# EasyEDA Pro project USB Hub Switch.eprj, schematic Smart Switch Variant

## Sheets
1 Upstream Ports: Board Name: Smart Switch Variant; Create Date: 2026-01-22; Page Name: Upstream Ports; Project Name: USB Hub Switch; Schematic Name: Smart Switch Variant; Update Date: 2026-01-29
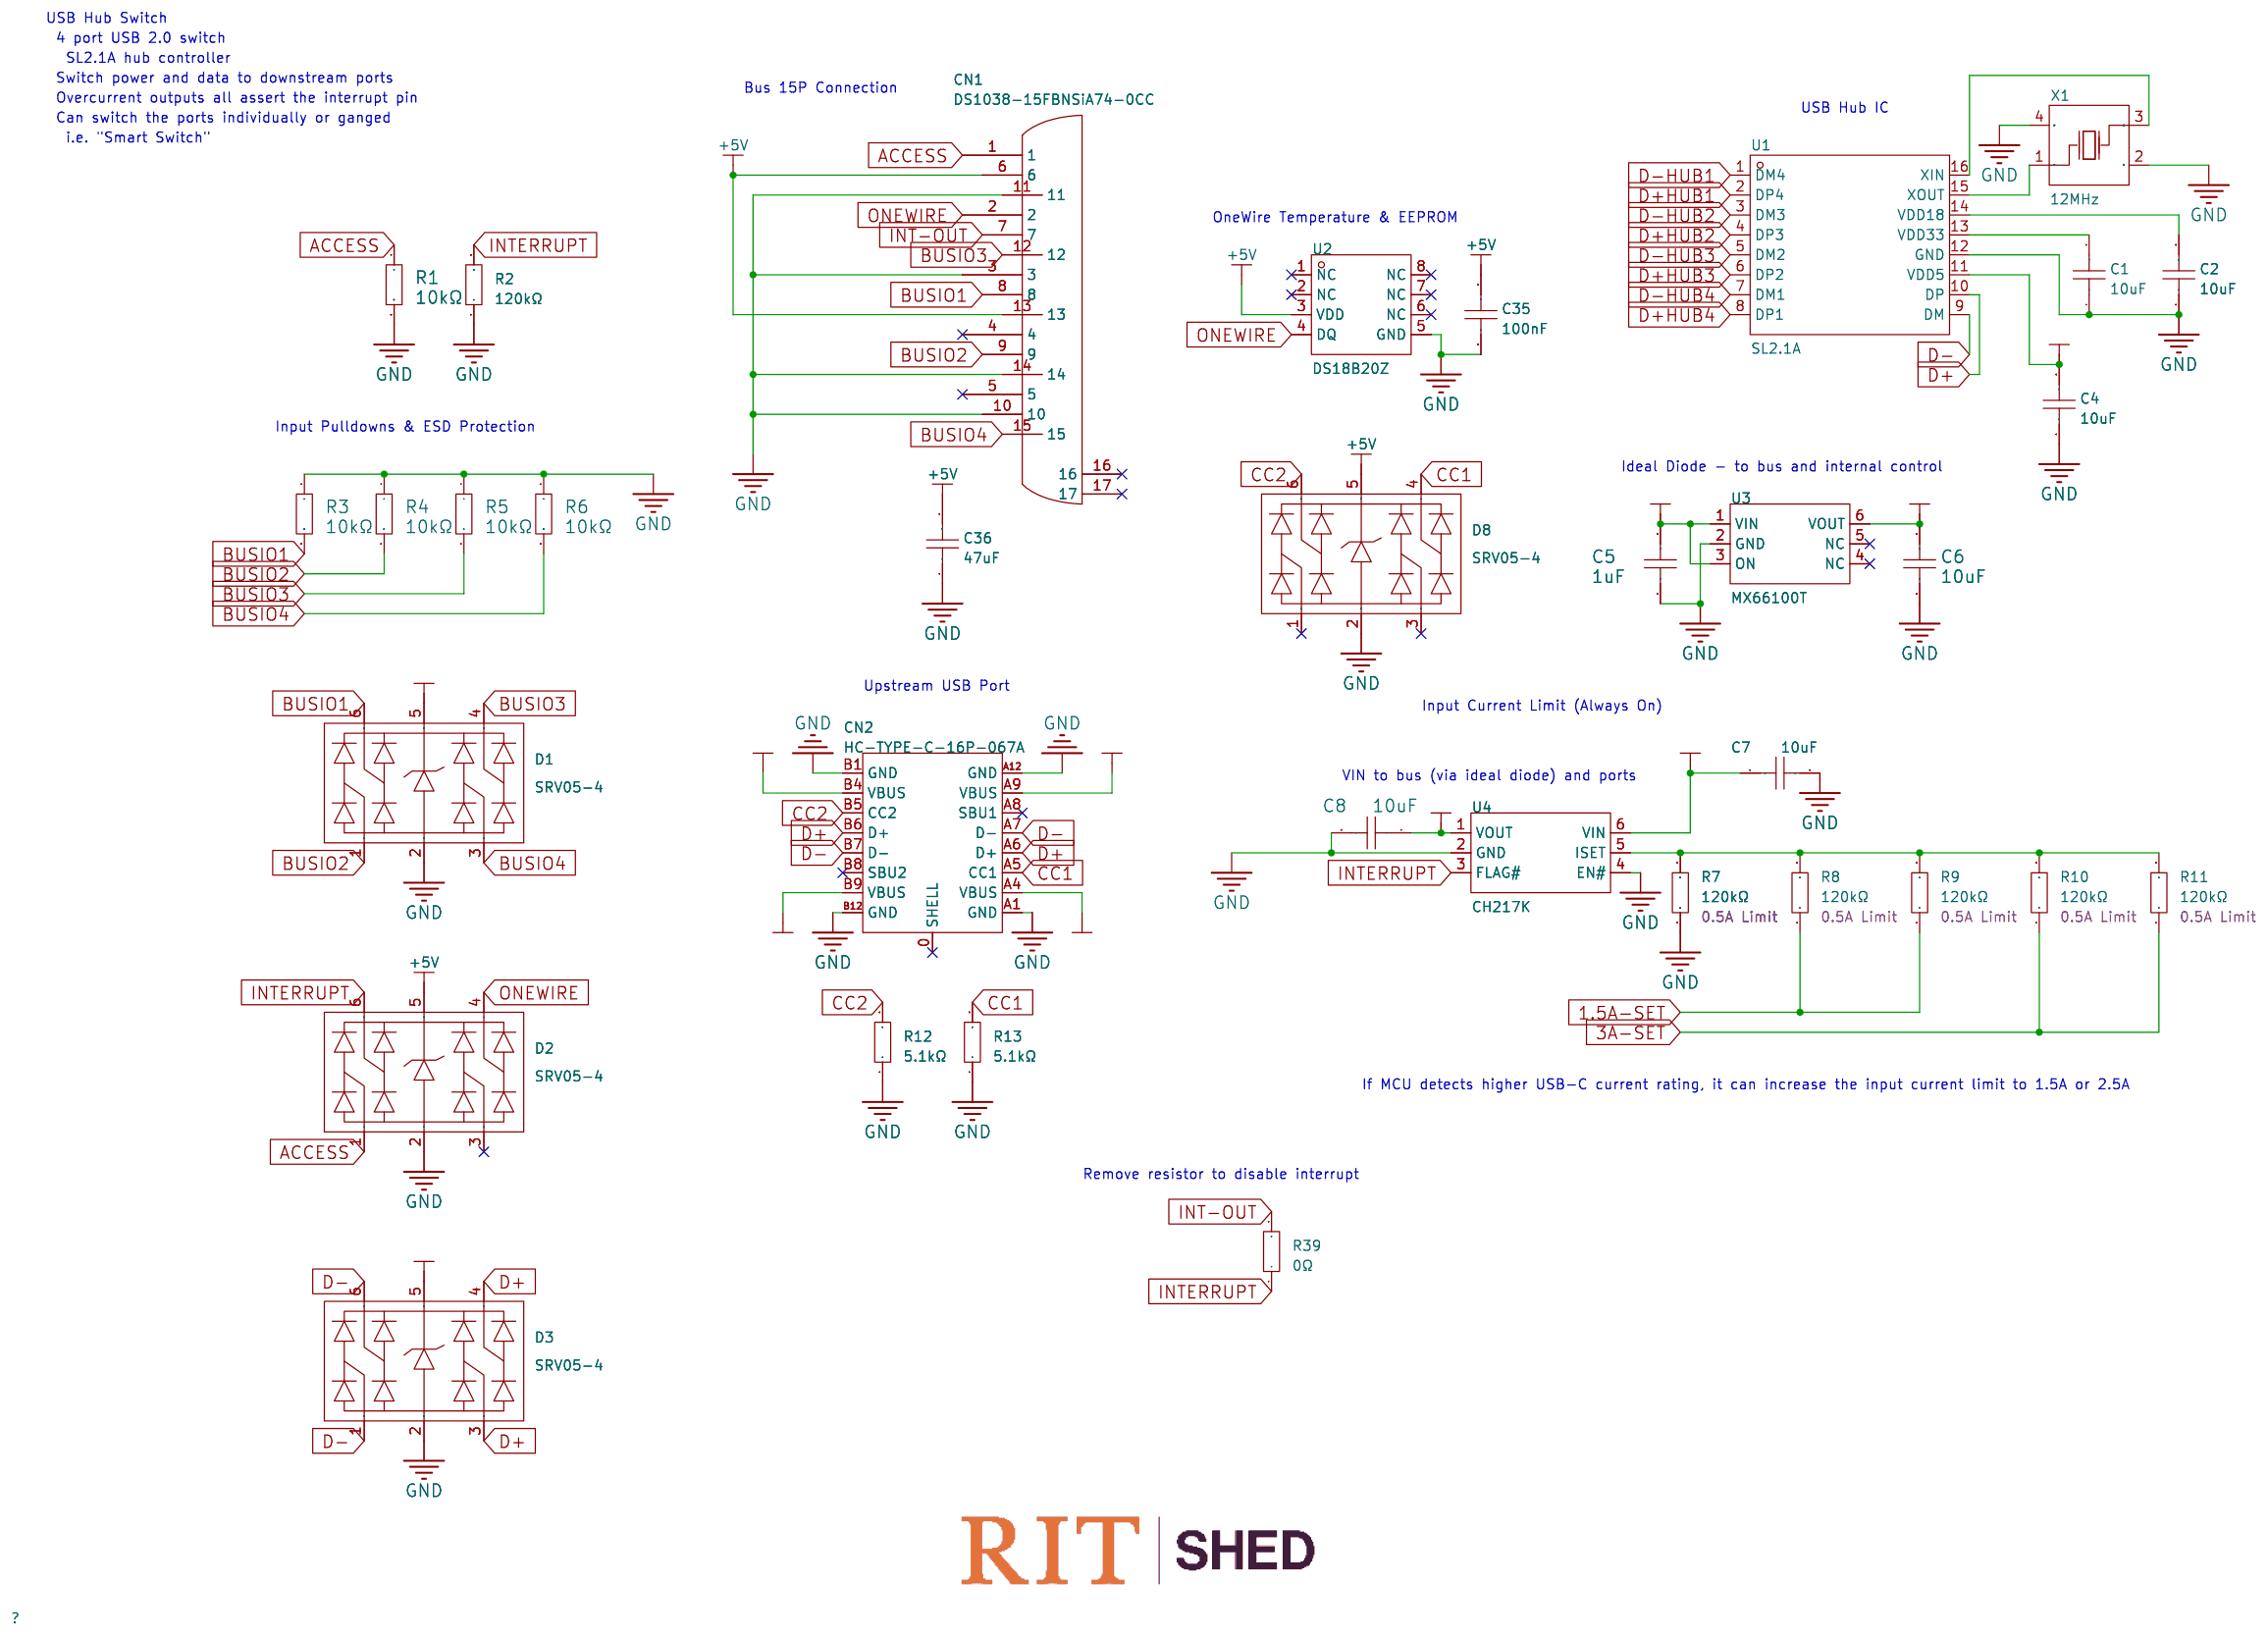
[diagram p0: Upstream Ports]
2 Downstream Ports: Page Name: Downstream Ports; Update Date: 2026-01-27
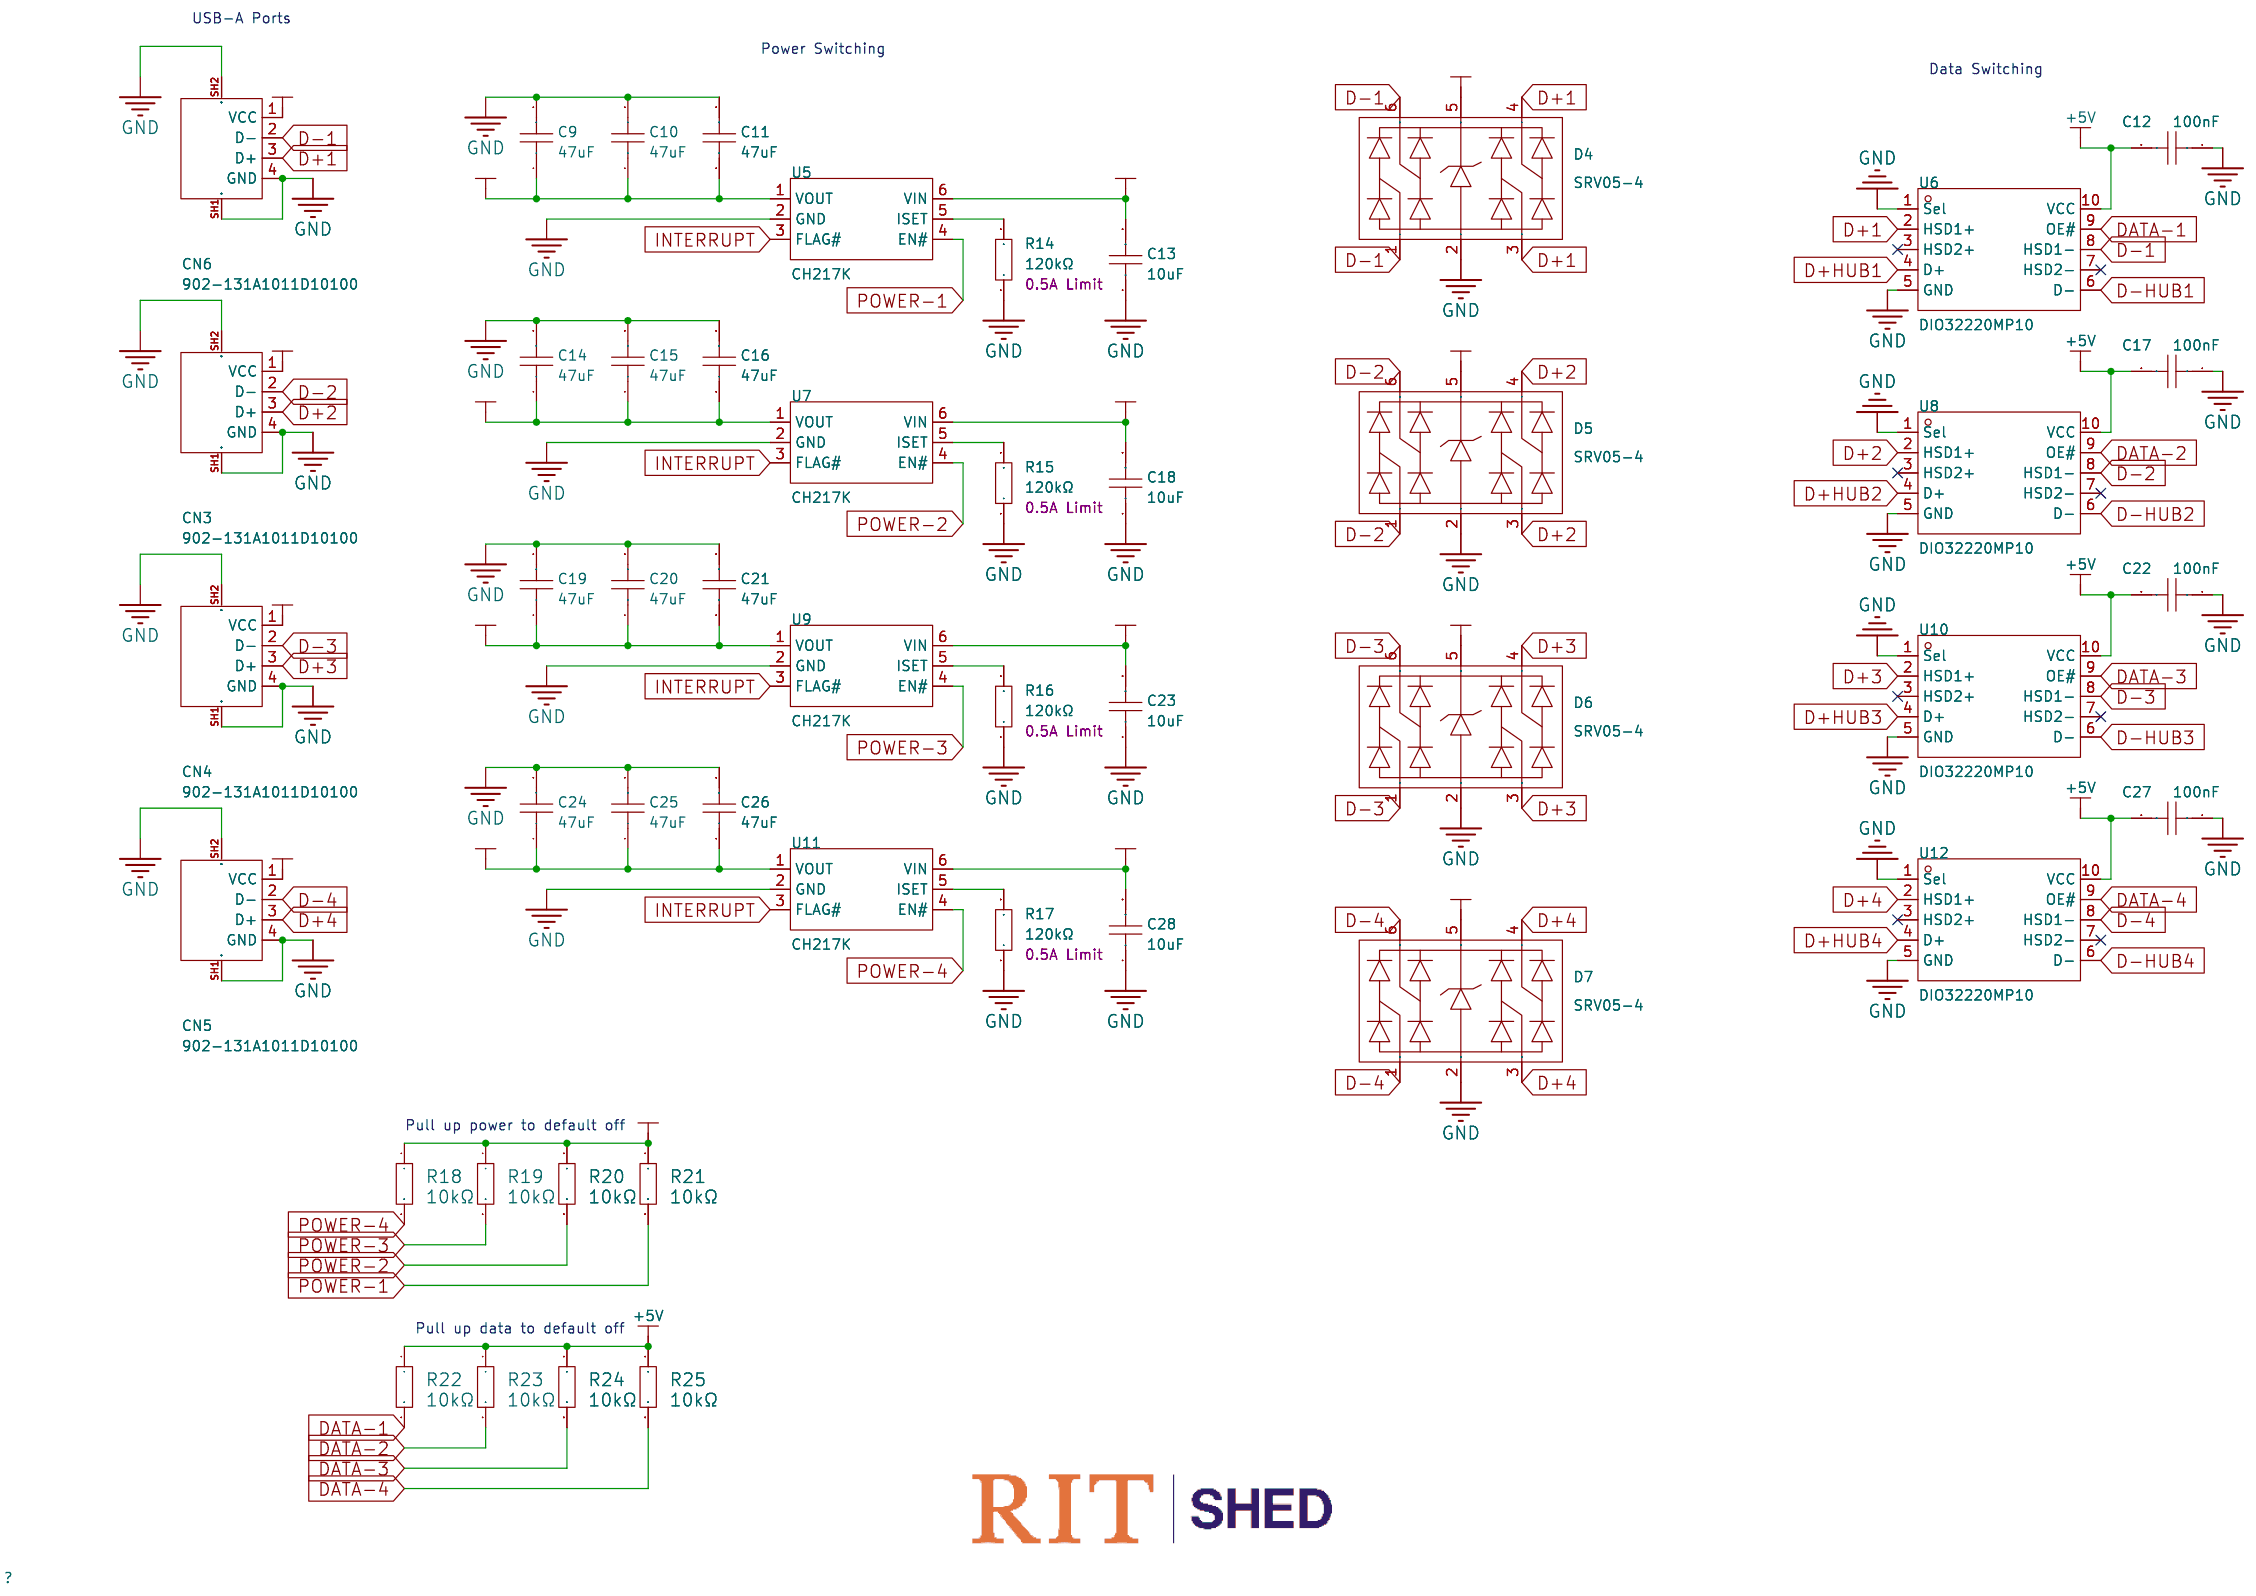
[diagram p1: Downstream Ports]
3 Microcontroller: Page Name: Microcontroller; Update Date: 2026-01-27
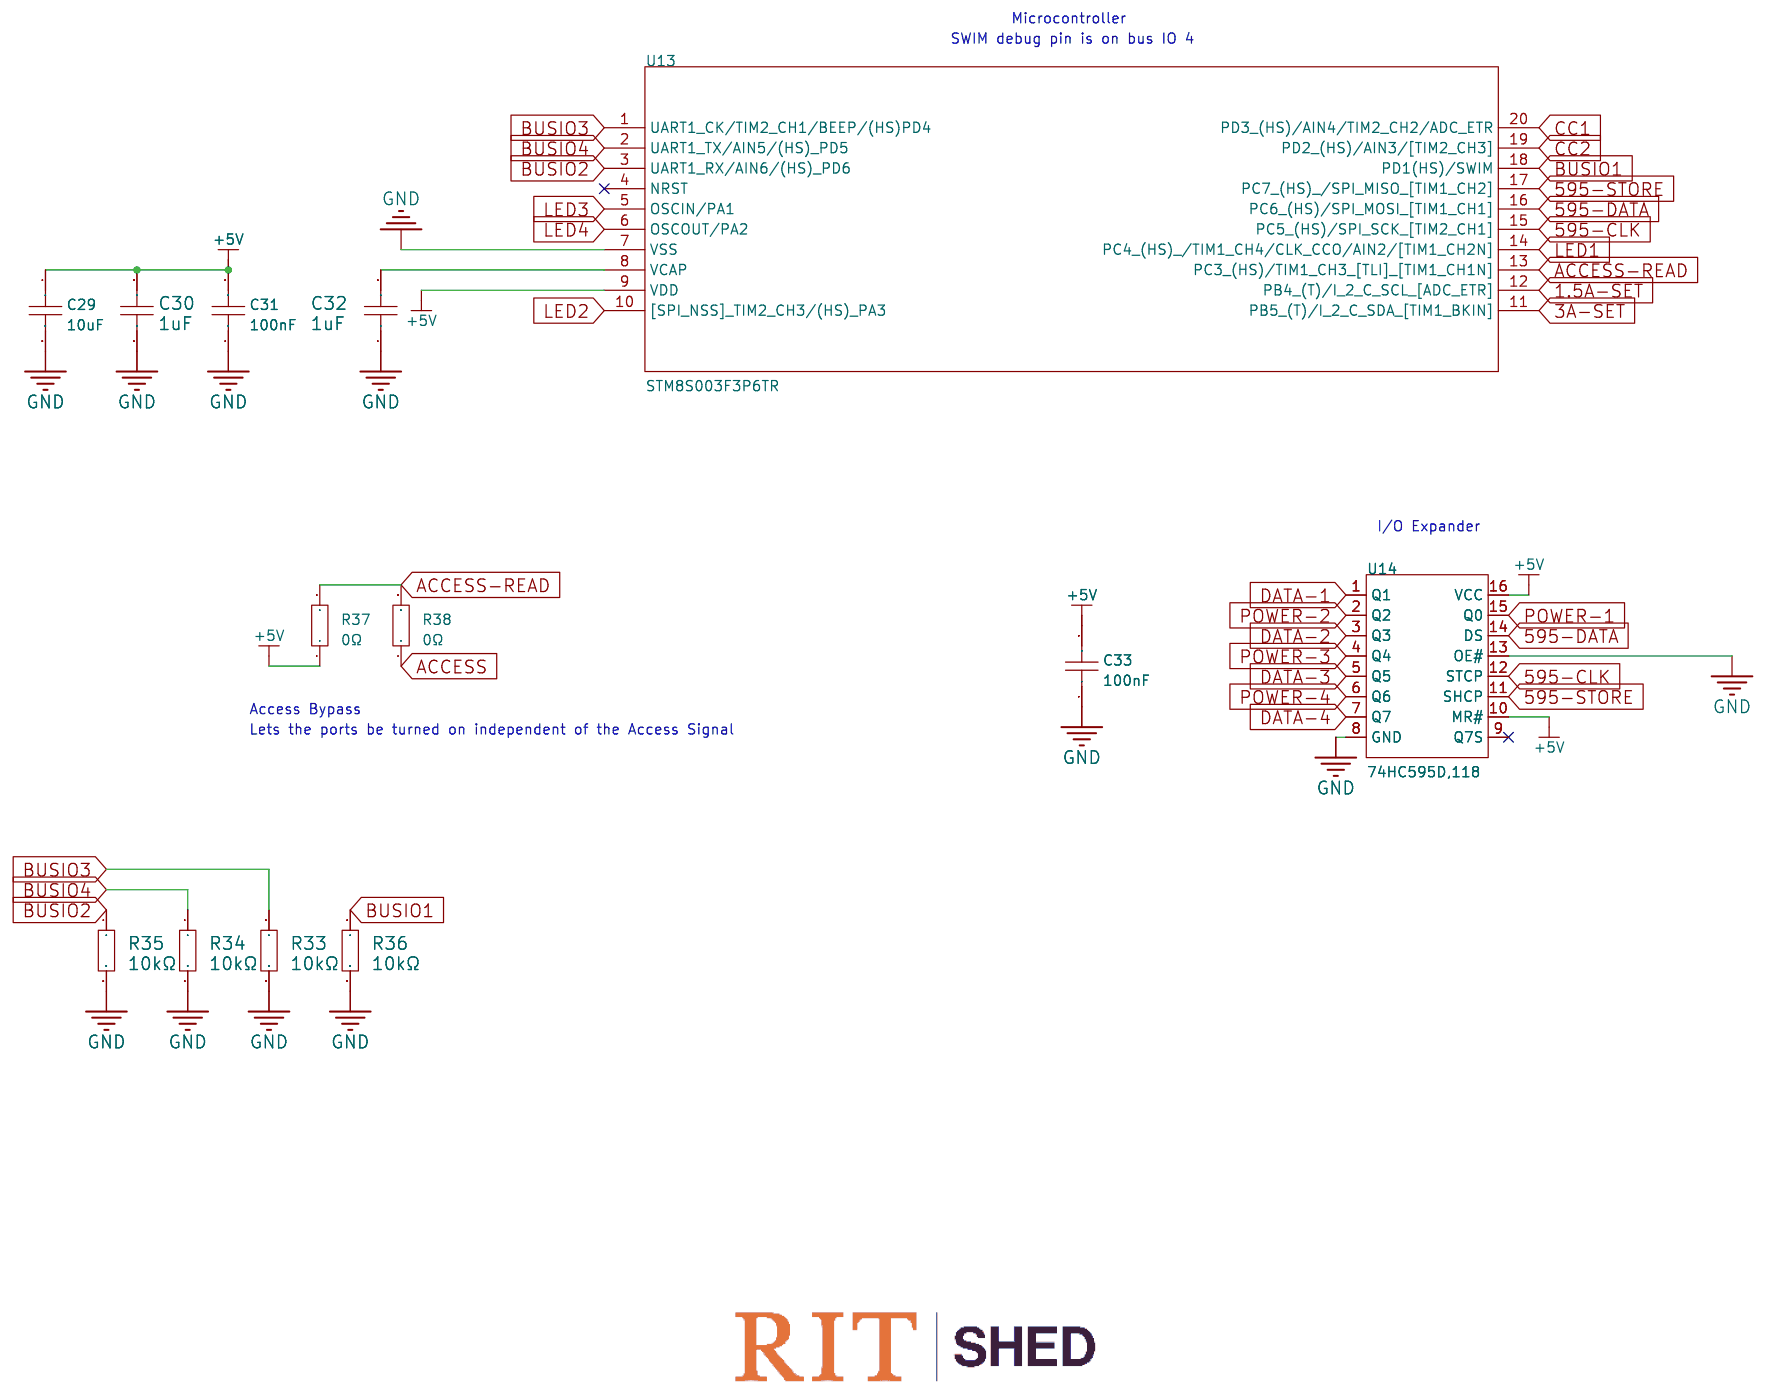
[diagram p2: Microcontroller]
4 Status LEDs: Create Date: 2026-01-23; Page Name: Status LEDs; Update Date: 2026-01-27
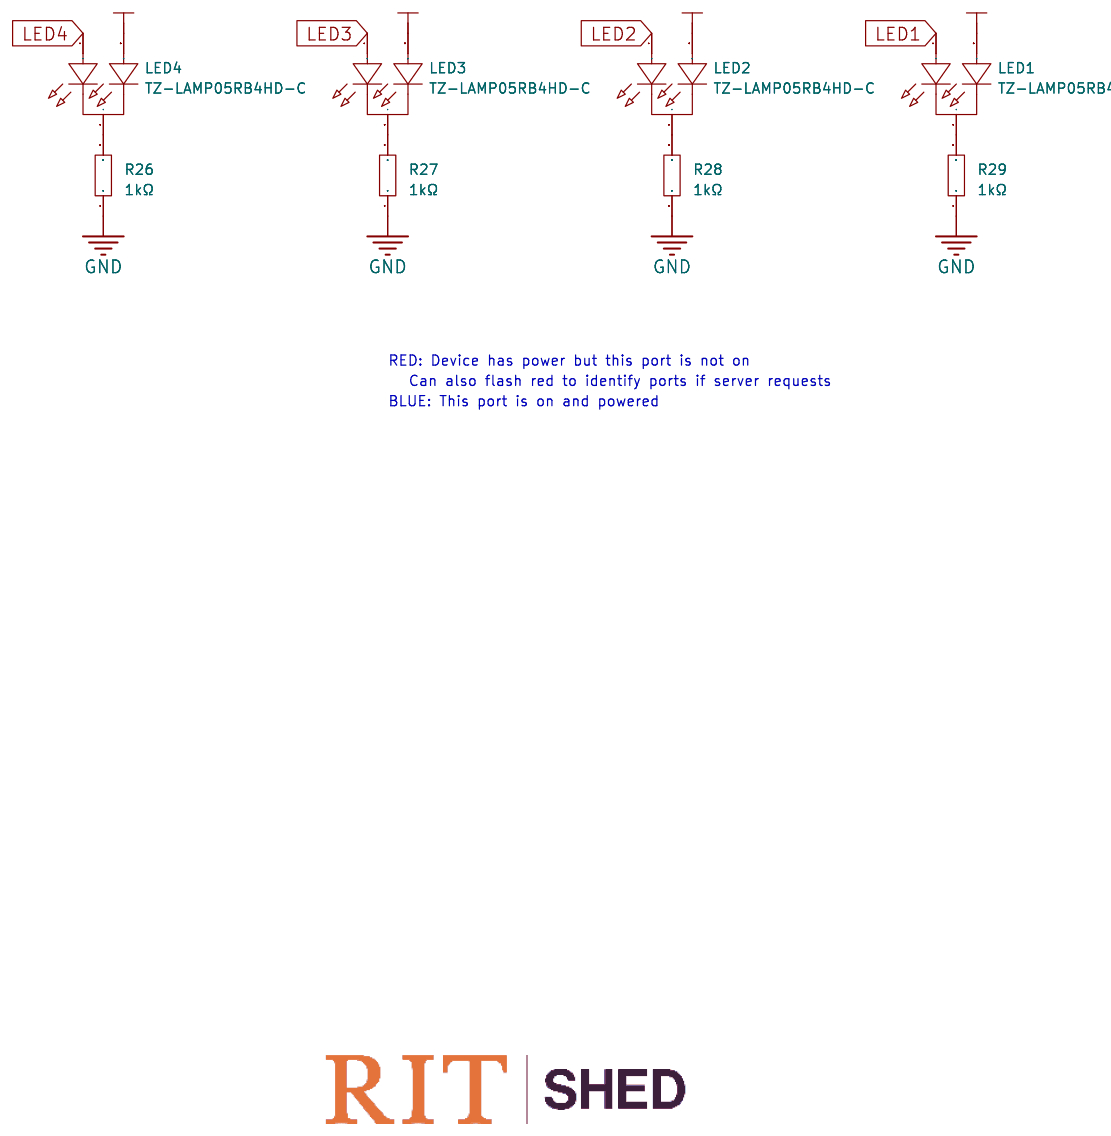
[diagram p3: Status LEDs]

## Parts
sheet Downstream Ports
C9  47uF  [C1206]
C10  47uF  [C1206]
C11  47uF  [C1206]
C12  100nF  [C0603]
C13  10uF  [C0603]
C14  47uF  [C1206]
C15  47uF  [C1206]
C16  47uF  [C1206]
C17  100nF  [C0603]
C18  10uF  [C0603]
C19  47uF  [C1206]
C20  47uF  [C1206]
C21  47uF  [C1206]
C22  100nF  [C0603]
C23  10uF  [C0603]
C24  47uF  [C1206]
C25  47uF  [C1206]
C26  47uF  [C1206]
C27  100nF  [C0603]
C28  10uF  [C0603]
CN3  902-131A1011D10100  [USB-A-TH__USB-AF-90]
CN4  902-131A1011D10100  [USB-A-TH__USB-AF-90]
CN5  902-131A1011D10100  [USB-A-TH__USB-AF-90]
CN6  902-131A1011D10100  [USB-A-TH__USB-AF-90]
D4  SRV05-4  [SOT-23-6_L2.9-W1.6-P0.95-LS2.8-BL]
D5  SRV05-4  [SOT-23-6_L2.9-W1.6-P0.95-LS2.8-BL]
D6  SRV05-4  [SOT-23-6_L2.9-W1.6-P0.95-LS2.8-BL]
D7  SRV05-4  [SOT-23-6_L2.9-W1.6-P0.95-LS2.8-BL]
R14  120kΩ  [R0603]
R15  120kΩ  [R0603]
R16  120kΩ  [R0603]
R17  120kΩ  [R0603]
R18  10kΩ  [R0603]
R19  10kΩ  [R0603]
R20  10kΩ  [R0603]
R21  10kΩ  [R0603]
R22  10kΩ  [R0603]
R23  10kΩ  [R0603]
R24  10kΩ  [R0603]
R25  10kΩ  [R0603]
U5  CH217K  [SOT-23-6_L2.9-W1.6-P0.95-LS2.8-BL]
U6  DIO32220MP10  [MSOP-10_L3.0-W3.0-P0.50-LS5.0-BL]
U7  CH217K  [SOT-23-6_L2.9-W1.6-P0.95-LS2.8-BL]
U8  DIO32220MP10  [MSOP-10_L3.0-W3.0-P0.50-LS5.0-BL]
U9  CH217K  [SOT-23-6_L2.9-W1.6-P0.95-LS2.8-BL]
U10  DIO32220MP10  [MSOP-10_L3.0-W3.0-P0.50-LS5.0-BL]
U11  CH217K  [SOT-23-6_L2.9-W1.6-P0.95-LS2.8-BL]
U12  DIO32220MP10  [MSOP-10_L3.0-W3.0-P0.50-LS5.0-BL]
sheet Microcontroller
C29  10uF  [C0603]
C30  1uF  [C0603]
C31  100nF  [C0603]
C32  1uF  [C0603]
C33  100nF  [C0603]
R33  10kΩ  [R0603]
R34  10kΩ  [R0603]
R35  10kΩ  [R0603]
R36  10kΩ  [R0603]
R37  0Ω  [R0805]
R38  0Ω  [R0805]
U13  STM8S003F3P6TR  [TSSOP-20_L6.5-W4.4-P0.65-LS6.4-BL]
U14  74HC595D,118  [SOIC-16_L9.9-W3.9-P1.27-LS6.0-BL]
sheet Status LEDs
LED1  TZ-LAMP05RB4HD-C  [LED-TH_3P-BD5.8-P2.54-R-BI]
LED2  TZ-LAMP05RB4HD-C  [LED-TH_3P-BD5.8-P2.54-R-BI]
LED3  TZ-LAMP05RB4HD-C  [LED-TH_3P-BD5.8-P2.54-R-BI]
LED4  TZ-LAMP05RB4HD-C  [LED-TH_3P-BD5.8-P2.54-R-BI]
R26  1kΩ  [R0805]
R27  1kΩ  [R0805]
R28  1kΩ  [R0805]
R29  1kΩ  [R0805]
sheet Upstream Ports
C1  10uF  [C0603]
C2  10uF  [C0603]
C4  10uF  [C0603]
C5  1uF  [C0603]
C6  10uF  [C0603]
C7  10uF  [C0603]
C8  10uF  [C0603]
C35  100nF  [C0603]
C36  47uF  [C1206]
CN1  DS1038-15FBNSiA74-0CC  [DSUB-TH_DS1038-15FBNSIA74-0CC]
CN2  HC-TYPE-C-16P-067A  [USB-SMD_HC-TYPE-C-16P-FLS7.2-5A-11]
D1  SRV05-4  [SOT-23-6_L2.9-W1.6-P0.95-LS2.8-BL]
D2  SRV05-4  [SOT-23-6_L2.9-W1.6-P0.95-LS2.8-BL]
D3  SRV05-4  [SOT-23-6_L2.9-W1.6-P0.95-LS2.8-BL]
D8  SRV05-4  [SOT-23-6_L2.9-W1.6-P0.95-LS2.8-BL]
R1  10kΩ  [R0603]
R2  120kΩ  [R0603]
R3  10kΩ  [R0603]
R4  10kΩ  [R0603]
R5  10kΩ  [R0603]
R6  10kΩ  [R0603]
R7  120kΩ  [R0603]
R8  120kΩ  [R0603]
R9  120kΩ  [R0603]
R10  120kΩ  [R0603]
R11  120kΩ  [R0603]
R12  5.1kΩ  [R0603]
R13  5.1kΩ  [R0603]
R39  0Ω  [R0805]
U1  SL2.1A  [SOP-16_L10.0-W3.9-P1.27-LS6.0-BL]
U2  DS18B20Z  [SOP-8_L4.9-W3.9-P1.27-LS6.0-BL]
U3  MX66100T  [SOT-23-6_L2.9-W1.6-P0.95-LS2.9-BL]
U4  CH217K  [SOT-23-6_L2.9-W1.6-P0.95-LS2.8-BL]
X1  12MHz  [OSC-SMD_4P-L3.2-W2.5-BL]

## Library data of the parts
C9-C11 C14-C16 C19-C21 C24-C26 C36 = CL31A476MPHNNNE: LCSC Part Name: 47uF ±20% 10V; Supplier Part: C96123; Manufacturer: SAMSUNG(三星); Supplier Footprint: 1206; Datasheet: https://item.szlcsc.com/datasheet/CL31A476MPHNNNE/97327.html; Supplier: LCSC; Tolerance: ±20%; Voltage Rating: 10V; Temperature Coefficient: X5R
C12 C17 C22 C27 C31 C33 C35 = CC0603KRX7R9BB104: LCSC Part Name: 100nF ±10% 50V; Supplier Part: C14663; Manufacturer: YAGEO(国巨); Supplier Footprint: 0603; JLCPCB Part Class: Basic Part; Datasheet: https://item.szlcsc.com/datasheet/CC0603KRX7R9BB104/15331.html; Supplier: LCSC; Tolerance: ±10%; Voltage Rating: 50V; Temperature Coefficient: X7R
C1 C2 C4 C7 C13 C18 C23 C28 C29 = CL10A106MA8NRNC: Capacitance: Tolerance:±20% Tolerance:±20% Voltage Rated: Temperature Coefficient:; LCSC Part Name: 10uF ±20% 25V; Supplier Part: C96446; Manufacturer: SAMSUNG(三星); Supplier Footprint: 0603; Datasheet: https://atta.szlcsc.com/upload/public/pdf/source/20170325/1490427913016.pdf; Supplier: LCSC; Tolerance: ±20%
CN3-CN6 = 902-131A1011D10100: LCSC Part Name: Type-A 母; Supplier Part: C2345; Manufacturer: 精拓金; Supplier Footprint: 插件; JLCPCB Part Class: Extended Part; Datasheet: https://item.szlcsc.com/datasheet/902-131A1011D10100/2721.html; Supplier: LCSC; Connector Type: Type-A; Protocol Standard: USB 2.0; Gender: Female; Number of Contacts: 4P; Number of Ports: 1; Current Rating-Power: 1.5A; Voltage Rating: 30V; Connect-Disconnect Life: 1500 Cycles; Length: 14.1mm; Detection color: White
D1-D8 = SRV05-4_C558418: polarity:Unidirectional Reverse Stand-Off Voltage (Vrwm):5V Maximum Clamping Voltage:20V Peak Pulse Current (Ipp):3A Peak Pulse Power Dissipation (Ppp):60W Breakdown Voltage:6V Reverse Leakage Current (Ir):500nA Number of Lines:Four channels Operating Tem; LCSC Part Name: ESD，可防25kV静电; Supplier Part: C558418; Manufacturer: TECH PUBLIC(台舟); Supplier Footprint: SOT-23-6; JLCPCB Part Class: Extended Part; Datasheet: https://atta.szlcsc.com/upload/public/pdf/source/20230615/CFFDFFE99FDA0E92DF9600783B3A2A20.pdf; Supplier: LCSC; polarity: Unidirectional; Reverse Stand-Off Voltage (Vrwm): 5V; Maximum Clamping Voltage: 20V; Peak Pulse Current (Ipp): 3A; Peak Pulse Power Dissipation (Ppp): 60W; Breakdown Voltage: 6V; Reverse Leakage Current (Ir): 500nA; Number of Lines: Four channels; Operating Temperature: -55℃~+125℃; level of protection: IEC 61000-4-2; Type: ESD
R2 R7-R11 R14-R17 = 0603WAF1203T5E: LCSC Part Name: 120kΩ ±1% 100mW 厚膜电阻; Supplier Part: C25808; Manufacturer: UNI-ROYAL(厚声); Supplier Footprint: 0603; Datasheet: https://item.szlcsc.com/datasheet/0603WAF1203T5E/26551.html; Supplier: LCSC; Type: Thick Film Resistor; Tolerance: ±1%; Power(Watts): 100mW; Voltage-Supply(Max): 75V; Temperature Coefficient: ±100ppm/℃; Operating Temperature: -55℃~+155℃; Note: 0.5A Limit
R1 R3-R6 R18-R25 R33-R36 = 0603WAF1002T5E: Type:Thick Film Resistors Resistance:10kΩ Tolerance:±1% Tolerance:±1% Power(Watts): Overload Voltage (Max): Temperature Coefficient:±100ppm/℃ Temperature Coefficient:±100ppm/℃ Operating Temperature Range:-55℃~+155℃ Operating Temperature Range:-55℃~+155℃; LCSC Part Name: 厚膜电阻 10kΩ ±1% 100mW; Supplier Part: C25804; Manufacturer: UNI-ROYAL(厚声); Supplier Footprint: 0603; JLCPCB Part Class: Basic Part; Datasheet: https://atta.szlcsc.com/upload/public/pdf/source/20200306/C422600_1E6D84923E4A46A82E41ADD87F860B5C.pdf; Supplier: LCSC; Type: Thick Film Resistors; Tolerance: ±1%; Temperature Coefficient: ±100ppm/℃; Operating Temperature Range: -55℃~+155℃
U4 U5 U7 U9 U11 = CH217K: LCSC Part Name: USB 限流配电开关芯片; Supplier Part: C7462749; Manufacturer: WCH(南京沁恒); Supplier Footprint: SOT-23-6; JLCPCB Part Class: Extended Part; Datasheet: https://item.szlcsc.com/datasheet/CH217K/8495424.html; Supplier: LCSC; Type: Load Switch; Number of Channels: 1; Control Input Logic: Active Low; Output Current: 2.7A; Voltage - Supply: 2.7V~5.5V; RDS(on): 70mΩ; Operating Temperature	-: -40℃~+85℃
U6 U8 U10 U12 = DIO32220MP10: LCSC Part Name: 低功耗，USB2.0高速开关; Supplier Part: C444624; Manufacturer: DIOO(帝奥微); Supplier Footprint: MSOP-10; Datasheet: https://item.szlcsc.com/datasheet/DIO32220MP10/445952.html; Supplier: LCSC; USB Protocol: USB 2.0; Voltage - Supply: 2.7V~5.5V; Data Rate: 480Mbps; Operating Temperature: -40℃~+85℃
C5 C30 C32 = CL10A105KB8NNNC: Capacitance: Tolerance:±10% Tolerance:±10% Voltage Rated: Temperature Coefficient:; LCSC Part Name: 1uF ±10% 50V; Supplier Part: C15849; Manufacturer: SAMSUNG(三星); Supplier Footprint: 0603; JLCPCB Part Class: Basic Part; Datasheet: https://atta.szlcsc.com/upload/public/pdf/source/20160218/1457707763339.pdf; Supplier: LCSC; Tolerance: ±10%
R37-R39 = 0805W8F0000T5E_C17477: LCSC Part Name: 0Ω ±1% 125mW 厚膜电阻; Supplier Part: C17477; Manufacturer: UNI-ROYAL(厚声); Manufacturer Part: 0805W8F0000T5E; Supplier Footprint: 0805; Datasheet: https://item.szlcsc.com/datasheet/0805W8F0000T5E/18165.html; Supplier: LCSC; Type: Thick Film Resistor; Tolerance: ±1%; Power(Watts): 125mW; Voltage-Supply(Max): 150V; Temperature Coefficient: ±800ppm/℃; Operating Temperature: -55℃~+155℃
U13 = STM8S003F3P6TR: LCSC Part Name: 主流超值系列8位MCU，具有8 KB Flash、16 MHz CPU和集成EEPROM; Supplier Part: C52717; Manufacturer: ST(意法半导体); Supplier Footprint: TSSOP-20; JLCPCB Part Class: Extended Part; Datasheet: https://item.szlcsc.com/datasheet/STM8S003F3P6TR/53732.html; Supplier: LCSC; CPU Core: STM8; CPU Maximum Speed: 16MHz; Program Storage Size: 8KB; Program Memory Type: FLASH; EEPROM: 128Byte; Number of I/O: 16; ADC (Bit): 10bit; Voltage - Supply: 2.95V~5.5V
U14 = 74HC595D,118: LCSC Part Name: 三态输出 串行至串行或并行移位寄存器; Supplier Part: C5947; Manufacturer: Nexperia(安世); Supplier Footprint: SOIC-16; JLCPCB Part Class: Basic Part; Datasheet: https://item.szlcsc.com/datasheet/74HC595D%252C118/6413.html; Supplier: LCSC; Function: Serial-to-Serial or Parallel; Voltage - Supply: 2V~6V; Clock Frequency: 100MHz; Number of Elements: 1; Number of Bits per Element: 8; Output Type: Tri-State; Series: 74HC; Operating Temperature: -40℃~+125℃; Propagation Delay: 19ns@4.5V,50pF
LED1-LED4 = TZ-LAMP05RB4HD-C: LCSC Part Name: 红灯,蓝灯; Supplier Part: C779425; Manufacturer: TUOZHAN(拓展光电); Supplier Footprint: 插件,D=5mm; Datasheet: https://item.szlcsc.com/datasheet/TZ-LAMP05RB4HD-C/829086.html; Supplier: LCSC; Lamp Holder Type: 5 mm round LED; Illumination Color: Red, Blue; Voltage - Forward(Vf): 1.9V~2.4V；2.8V~3.4V; Power(Watts): 90mW；60mW; Forward Current: 20mA; Wavelength - Dominant: 465nm~470nm；620nm~625nm; Diode Configuration: Common Cathode; Luminous Intensity: 200mcd；300mcd; Viewing Angle: 60°; Operating Temperature: -40℃~+80℃
R26-R29 = 0805W8F1001T5E: Type:Thick Film Resistors Resistance:1kΩ Tolerance:±1% Tolerance:±1% Power(Watts): Overload Voltage (Max): Temperature Coefficient:±100ppm/℃ Temperature Coefficient:±100ppm/℃ Operating Temperature Range:-55℃~+155℃ Operating Temperature Range:-55℃~+155℃; LCSC Part Name: 1kΩ ±1% 125mW 厚膜电阻; Supplier Part: C17513; Manufacturer: UNI-ROYAL(厚声); Supplier Footprint: 0805; Datasheet: https://atta.szlcsc.com/upload/public/pdf/source/20200306/C422600_1E6D84923E4A46A82E41ADD87F860B5C.pdf; Supplier: LCSC; Type: Thick Film Resistors; Tolerance: ±1%; Temperature Coefficient: ±100ppm/℃; Operating Temperature Range: -55℃~+155℃
C6 C8 = CL10A106MA8NRNC: Capacitance:10uF Tolerance:±20% Tolerance:±20% Voltage Rating:25V Temperature Coefficient:X5R; LCSC Part Name: 10uF ±20% 25V; Supplier Part: C96446; Manufacturer: SAMSUNG(三星); Supplier Footprint: 0603; JLCPCB Part Class: Basic Part; Datasheet: https://item.szlcsc.com/datasheet/CL10A106MA8NRNC/97651.html; Supplier: LCSC; Tolerance: ±20%; Voltage Rating: 25V; Temperature Coefficient: X5R
CN1 = DS1038-15FBNSiA74-0CC: Connector Type:High Density D-Sub Gender:Female Number of Pins:15P Mounting Type:Right Angle Number of Rows:3 Current Rating-Signal:3A Current Rating-Power:- Voltage Rating:- Color:Black Operating Temperature:-40℃~+105℃ Operating Temperature:-40℃~+105℃; LCSC Part Name: 黑色 1000/盒 D-Sub 母 P数:15P; Supplier Part: C75754; Manufacturer: CONNFLY; Supplier Footprint: 弯插; JLCPCB Part Class: Extended Part; Datasheet: https://item.szlcsc.com/datasheet/DS1038-15FBNSiA74-0CC/76880.html; Supplier: LCSC; Connector Type: High Density D-Sub; Gender: Female; Number of Pins: 15P; Mounting Type: Right Angle; Number of Rows: 3; Current Rating-Signal: 3A; Color: Black; Operating Temperature: -40℃~+105℃
CN2 = HC-TYPE-C-16P-067A: LCSC Part Name: Type-C 母 侧贴; Supplier Part: C48887186; Manufacturer: HC(虹成电子); Supplier Footprint: SMD; JLCPCB Part Class: Extended Part; Datasheet: https://item.szlcsc.com/datasheet/HC-TYPE-C-16P-067A/51189226.html; Supplier: LCSC; Connector Type: Type-C; Gender: Female; Mounting Type: Side View Mount; Number of Contacts: 16P; Number of Ports: 1; Current Rating-Power: 5A; Connect-Disconnect Life: 10,000 Cycles; Center Height: 6.7mm; Length: 14mm; Detection color: Black; Operating Temperature: -55℃~+85℃
R12 R13 = 0603WAF5101T5E: LCSC Part Name: 5.1kΩ ±1% 100mW 厚膜电阻; Supplier Part: C23186; Manufacturer: UNI-ROYAL(厚声); Supplier Footprint: 0603; Datasheet: https://item.szlcsc.com/datasheet/0603WAF5101T5E/23913.html; Supplier: LCSC; Type: Thick Film Resistor; Tolerance: ±1%; Power(Watts): 100mW; Voltage-Supply(Max): 75V; Temperature Coefficient: ±100ppm/℃; Operating Temperature: -55℃~+155℃
U1 = SL2.1A: Applications Function: Protocol:; Supplier Part: C192893; Manufacturer: CoreChips(和芯润德); Supplier Footprint: SOP-16; JLCPCB Part Class: Extended Part; Datasheet: https://atta.szlcsc.com/upload/public/pdf/source/20180522/C192893_624110D24898D57AAC785E3DF98EA862.pdf; Supplier: LCSC
U2 = DS18B20Z: Resolution:±0.4℃ Resolution:±0.4℃ Supply Voltage:2.5V~5.5V Supply Voltage:2.5V~5.5V; LCSC Part Name: 温度传感器; Supplier Part: C695837; Manufacturer: UMW(友台半导体); Supplier Footprint: SOIC-8; JLCPCB Part Class: Extended Part; Datasheet: https://atta.szlcsc.com/upload/public/pdf/source/20231109/DC3DA9D47D486EF40A6E0F08B9A498E3.pdf; Supplier: LCSC; Resolution: ±0.4℃; Supply Voltage: 2.5V~5.5V
U3 = MX66100T: LCSC Part Name: 1V to 5.5V、2A、100mΩ理想二极管; Supplier Part: C53121238; Manufacturer: Wuxi Maxinmicro(无锡明芯微); Supplier Footprint: SOT23-6; JLCPCB Part Class: Extended Part; Datasheet: https://item.szlcsc.com/datasheet/MX66100T/56102987.html; Supplier: LCSC
X1 = X322512MSB4SI: Crystal Type:SMD Crystal Resonator Frequency: Frequency Tolerance:±10ppm Frequency Tolerance:±10ppm Frequency Stability:±30ppm Frequency Stability:±30ppm Load Capacitance: Operating Temperature: Operating Temperature:; LCSC Part Name: 12MHz ±10ppm 20pF; Supplier Part: C9002; Manufacturer: YXC(扬兴晶振); Supplier Footprint: SMD3225-4P; JLCPCB Part Class: Basic Part; Datasheet: https://atta.szlcsc.com/upload/public/pdf/source/20210329/C112971_1F611BDC486E193C1706F6D8EB5AA189.pdf; Supplier: LCSC; Crystal Type: SMD Crystal Resonator; Frequency Tolerance: ±10ppm; Frequency Stability: ±30ppm

## Nets
+5V: C6.2 C12.2 C17.2 C22.2 C27.2 C29.1 C30.2 C31.2 C33.2 C35.2 C36.2 CN1.6 CN1.13 D1.5 D2.5 D8.5 R22.1 R23.1 R24.1 R25.1 R37.1 U2.3(VDD) U3.6(VOUT) U6.10(VCC) U8.10(VCC) U10.10(VCC) U12.10(VCC) U13.9(VDD) U14.10(MR#) U14.16(VCC)
GND: C1.1 C2.1 C4.1 C5.1 C6.1 C7.1 C8.2 C9.2 C10.2 C11.2 C12.1 C13.1 C14.2 C15.2 C16.2 C17.1 C18.1 C19.2 C20.2 C21.2 C22.1 C23.1 C24.2 C25.2 C26.2 C27.1 C28.1 C29.2 C30.1 C31.1 C32.1 C33.1 C35.1 C36.1 CN1.3 CN1.10 CN1.11 CN1.14 CN2.A1(GND) CN2.A12(GND) CN2.B1(GND) CN2.B12(GND) CN3.4(GND) CN3.SH1 CN3.SH2 CN4.4(GND) CN4.SH1 CN4.SH2 CN5.4(GND) CN5.SH1 CN5.SH2 CN6.4(GND) CN6.SH1 CN6.SH2 D1.2 D2.2 D3.2 D4.2 D5.2 D6.2 D7.2 D8.2 R1.2 R2.1 R3.1 R4.1 R5.1 R6.1 R7.1 R12.1 R13.1 R14.1 R15.1 R16.1 R17.1 R26.1 R27.1 R28.1 R29.1 R33.2 R34.2 R35.2 R36.2 U1.12(GND) U2.5(GND) U3.2(GND) U4.2(GND) U4.4(EN#) U5.2(GND) U6.1(Sel) U6.5(GND) U7.2(GND) U8.1(Sel) U8.5(GND) U9.2(GND) U10.1(Sel) U10.5(GND) U11.2(GND) U12.1(Sel) U12.5(GND) U13.7(VSS) U14.8(GND) U14.13(OE#) X1.2(GND) X1.4(GND)
VIN: C4.2 C5.2 C8.1 C13.2 C18.2 C23.2 C28.2 R18.1 R19.1 R20.1 R21.1 U1.11(VDD5) U3.1(VIN) U3.3(ON) U4.1(VOUT) U5.6(VIN) U7.6(VIN) U9.6(VIN) U11.6(VIN)
1.5A-SET: R8.1 R9.1 U13.12(PB4 (T)/I 2 C_SCL [ADC_ETR])
3A-SET: R10.1 R11.1 U13.11(PB5 (T)/I 2 C_SDA [TIM1_BKIN])
595-CLK: U13.15(PC5 (HS)/SPI_SCK [TIM2_CH1]) U14.12(STCP)
595-DATA: U13.16(PC6 (HS)/SPI_MOSI [TIM1_CH1]) U14.14(DS)
595-STORE: U13.17(PC7 (HS) /SPI_MISO [TIM1_CH2]) U14.11(SHCP)
ACCESS: CN1.1 D2.1 R1.1 R38.1
ACCESS-READ: R37.2 R38.2 U13.13(PC3 (HS)/TIM1_CH3 [TLI] [TIM1_CH1N])
BUSIO1: CN1.8 D1.6 R3.2 R36.1 U13.18(PD1(HS)/SWIM)
BUSIO2: CN1.9 D1.1 R4.2 R35.1 U13.3(UART1_RX/AIN6/(HS) PD6)
BUSIO3: CN1.12 D1.4 R5.2 R33.1 U13.1(UART1_CK/TIM2_CH1/BEEP/(HS)PD4)
BUSIO4: CN1.15 D1.3 R6.2 R34.1 U13.2(UART1_TX/AIN5/(HS) PD5)
CC1: CN2.A5(CC1) D8.4 R13.2 U13.20(PD3 (HS)/AIN4/TIM2_CH2/ADC_ETR)
CC2: CN2.B5(CC2) D8.6 R12.2 U13.19(PD2 (HS)/AIN3/[TIM2_CH3])
D+: CN2.A6(D+) CN2.B6(D+) D3.3 D3.4 U1.10(DP)
D+1: CN6.3(D+) D4.3 D4.4 U6.2(HSD1+)
D+2: CN3.3(D+) D5.3 D5.4 U8.2(HSD1+)
D+3: CN4.3(D+) D6.3 D6.4 U10.2(HSD1+)
D+4: CN5.3(D+) D7.3 D7.4 U12.2(HSD1+)
D+HUB1: U1.2(DP4) U6.4(D+)
D+HUB2: U1.4(DP3) U8.4(D+)
D+HUB3: U1.6(DP2) U10.4(D+)
D+HUB4: U1.8(DP1) U12.4(D+)
D-: CN2.A7(D-) CN2.B7(D-) D3.1 D3.6 U1.9(DM)
D-1: CN6.2(D-) D4.1 D4.6 U6.8(HSD1-)
D-2: CN3.2(D-) D5.1 D5.6 U8.8(HSD1-)
D-3: CN4.2(D-) D6.1 D6.6 U10.8(HSD1-)
D-4: CN5.2(D-) D7.1 D7.6 U12.8(HSD1-)
D-HUB1: U1.1(DM4) U6.6(D-)
D-HUB2: U1.3(DM3) U8.6(D-)
D-HUB3: U1.5(DM2) U10.6(D-)
D-HUB4: U1.7(DM1) U12.6(D-)
DATA-1: R22.2 U6.9(OE#) U14.1(Q1)
DATA-2: R23.2 U8.9(OE#) U14.3(Q3)
DATA-3: R24.2 U10.9(OE#) U14.5(Q5)
DATA-4: R25.2 U12.9(OE#) U14.7(Q7)
INT-OUT: CN1.7 R39.2
INTERRUPT: D2.6 R2.2 R39.1 U4.3(FLAG#) U5.3(FLAG#) U7.3(FLAG#) U9.3(FLAG#) U11.3(FLAG#)
LED1: LED1.1(+) U13.14(PC4 (HS) /TIM1_CH4/CLK_CCO/AIN2/[TIM1_CH2N])
LED2: LED2.1(+) U13.10([SPI_NSS] TIM2_CH3/(HS) PA3)
LED3: LED3.1(+) U13.5(OSCIN/PA1)
LED4: LED4.1(+) U13.6(OSCOUT/PA2)
ONEWIRE: CN1.2 D2.4 U2.4(DQ)
POWER-1: R21.2 U5.4(EN#) U14.15(Q0)
POWER-2: R20.2 U7.4(EN#) U14.2(Q2)
POWER-3: R19.2 U9.4(EN#) U14.4(Q4)
POWER-4: R18.2 U11.4(EN#) U14.6(Q6)
VDS1: C9.1 C10.1 C11.1 CN6.1(VCC) D4.5 LED1.3(+) U5.1(VOUT)
VDS2: C14.1 C15.1 C16.1 CN3.1(VCC) D5.5 LED2.3(+) U7.1(VOUT)
VDS3: C19.1 C20.1 C21.1 CN4.1(VCC) D6.5 LED3.3(+) U9.1(VOUT)
VDS4: C24.1 C25.1 C26.1 CN5.1(VCC) D7.5 LED4.3(+) U11.1(VOUT)
VUSB: C7.2 CN2.A4(VBUS) CN2.A9(VBUS) CN2.B4(VBUS) CN2.B9(VBUS) D3.5 U4.6(VIN)
$1N390: U1.15(XOUT) X1.1(OSC1)
$1N404: C2.2 U1.14(VDD18)
$1N405: U1.16(XIN) X1.3(OSC2)
$1N406: C1.2 U1.13(VDD33)
$1N2303: R7.2 R8.2 R9.2 R10.2 R11.2 U4.5(ISET)
$2N997: R14.2 U5.5(ISET)
$2N2024: R15.2 U7.5(ISET)
$2N2374: R16.2 U9.5(ISET)
$2N2724: R17.2 U11.5(ISET)
$3N2300: C32.2 U13.8(VCAP)
$6N811: LED1.2(-) R29.2
$6N813: LED2.2(-) R28.2
$6N815: LED3.2(-) R27.2
$6N817: LED4.2(-) R26.2

Not connected (* = marked no-connect by the designer): CN1 4* 5* 16* 17*; CN2 0(SHELL)* A8(SBU1)* B8(SBU2)*; D2 3*; D8 1* 3*; U2 1(NC)* 2(NC)* 6(NC)* 7(NC)* 8(NC)*; U3 4(NC)* 5(NC)*; U6 3(HSD2+)* 7(HSD2-)*; U8 3(HSD2+)* 7(HSD2-)*; U10 3(HSD2+)* 7(HSD2-)*; U12 3(HSD2+)* 7(HSD2-)*; U13 4(NRST)*; U14 9(Q7S)*

## Notes on the sheets
sheet 1
- USB Hub Switch
- 4 port USB 2.0 switch
- SL2.1A hub controller
- Switch power and data to downstream ports
- Bus 15P Connection
- Overcurrent outputs all assert the interrupt pin
- USB Hub IC
- Can switch the ports individually or ganged
- i.e. "Smart Switch"
- OneWire Temperature & EEPROM
- Input Pulldowns & ESD Protection
- Ideal Diode - to bus and internal control
- Upstream USB Port
- Input Current Limit (Always On)
- VIN to bus (via ideal diode) and ports
- If MCU detects higher USB-C current rating, it can increase the input current limit to 1.5A or 2.5A
- Remove resistor to disable interrupt
sheet 2
- USB-A Ports
- Power Switching
- Data Switching
- Pull up power to default off
- Pull up data to default off
sheet 3
- Microcontroller
- SWIM debug pin is on bus IO 4
- I/O Expander
- Access Bypass
- Lets the ports be turned on independent of the Access Signal
sheet 4
- RED: Device has power but this port is not on
- Can also flash red to identify ports if server requests
- BLUE: This port is on and powered
